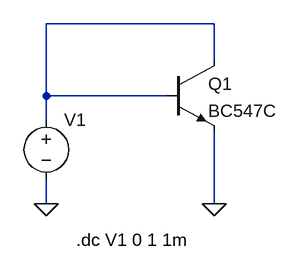
[diagram p0: schematic transistor-curva-entrada.asc]
transistor-curva-entrada.asc, the LTspice schematic file:
Version 4
SHEET 1 880 680
WIRE 208 32 -16 32
WIRE 208 80 208 32
WIRE -16 128 -16 32
WIRE 144 128 -16 128
WIRE -16 160 -16 128
WIRE -16 272 -16 240
WIRE 208 272 208 176
FLAG -16 272 0
FLAG 208 272 0
SYMBOL npn 144 80 R0
SYMATTR InstName Q1
SYMATTR Value BC547C
SYMBOL voltage -16 144 R0
WINDOW 3 24 44 Left 2
WINDOW 123 0 0 Left 0
WINDOW 39 0 0 Left 0
SYMATTR Value ""
SYMATTR InstName V1
TEXT 24 320 Left 2 !.dc V1 0 1 1m

The netlist it stands for:
* transistor-curva-entrada.asc
Q1 N001 N001 0 0 BC547C
V1 N001 0
.model NPN NPN
.model PNP PNP
.lib standard.bjt
.dc V1 0 1 1m
.backanno
.end